# EAGLE design display (EAGLE 7.2.0)
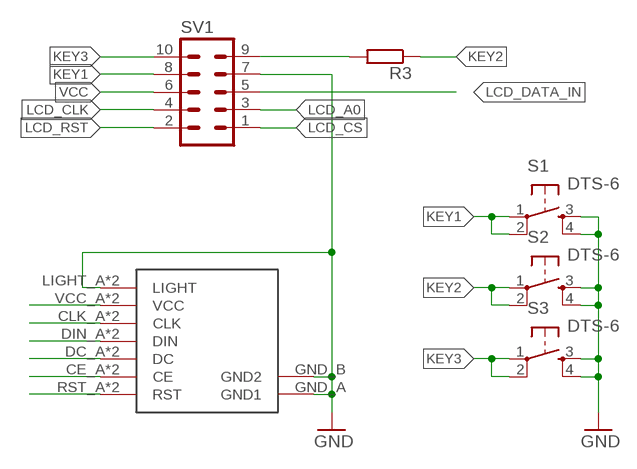
[diagram p0: schematic, sheet 1]

## Parts
R3  R-EU_R2010  [R2010]
S1  DTS-6  [DTS-6]
S2  DTS-6  [DTS-6]
S3  DTS-6  [DTS-6]
SV1  ML10L  [ML10L]
U$2  NOKIA5110_LCD  [NOKIA5110_LCD]

## Nets
GND: S1.3 S1.4 S2.3 S2.4 S3.3 S3.4 SV1.7 U$2.GND_A(GND1) U$2.GND_B(GND2) U$2.LIGHT_A(LIGHT) U$2.LIGHT_B(LIGHT)
KEY1: S1.1 S1.2 SV1.8
KEY2: R3.1 S2.1 S2.2
KEY3: S3.1 S3.2 SV1.10
LCD_A0: SV1.3 U$2.DC_A(DC) U$2.DC_B(DC)
LCD_CLK: SV1.4 U$2.CLK_A(CLK) U$2.CLK_B(CLK)
LCD_CS: SV1.1 U$2.CE_A(CE) U$2.CE_B(CE)
LCD_DATA_IN: SV1.5 U$2.DIN_A(DIN) U$2.DIN_B(DIN)
LCD_RST: SV1.2 U$2.RST_A(RST) U$2.RST_B(RST)
N$5: R3.2 SV1.9
VCC: SV1.6 U$2.VCC_A(VCC) U$2.VCC_B(VCC)

## Library data of the parts
R3 = rcl:R-EU_: RESISTOR, European symbol
S1-S3 = switch-tact:DTS-6
SV1 = con-ml:ML10L: HARTING; OC_FARNELL: unknown; OC_NEWARK: unknown
U$2 = common:NOKIA5110_LCD

## Board
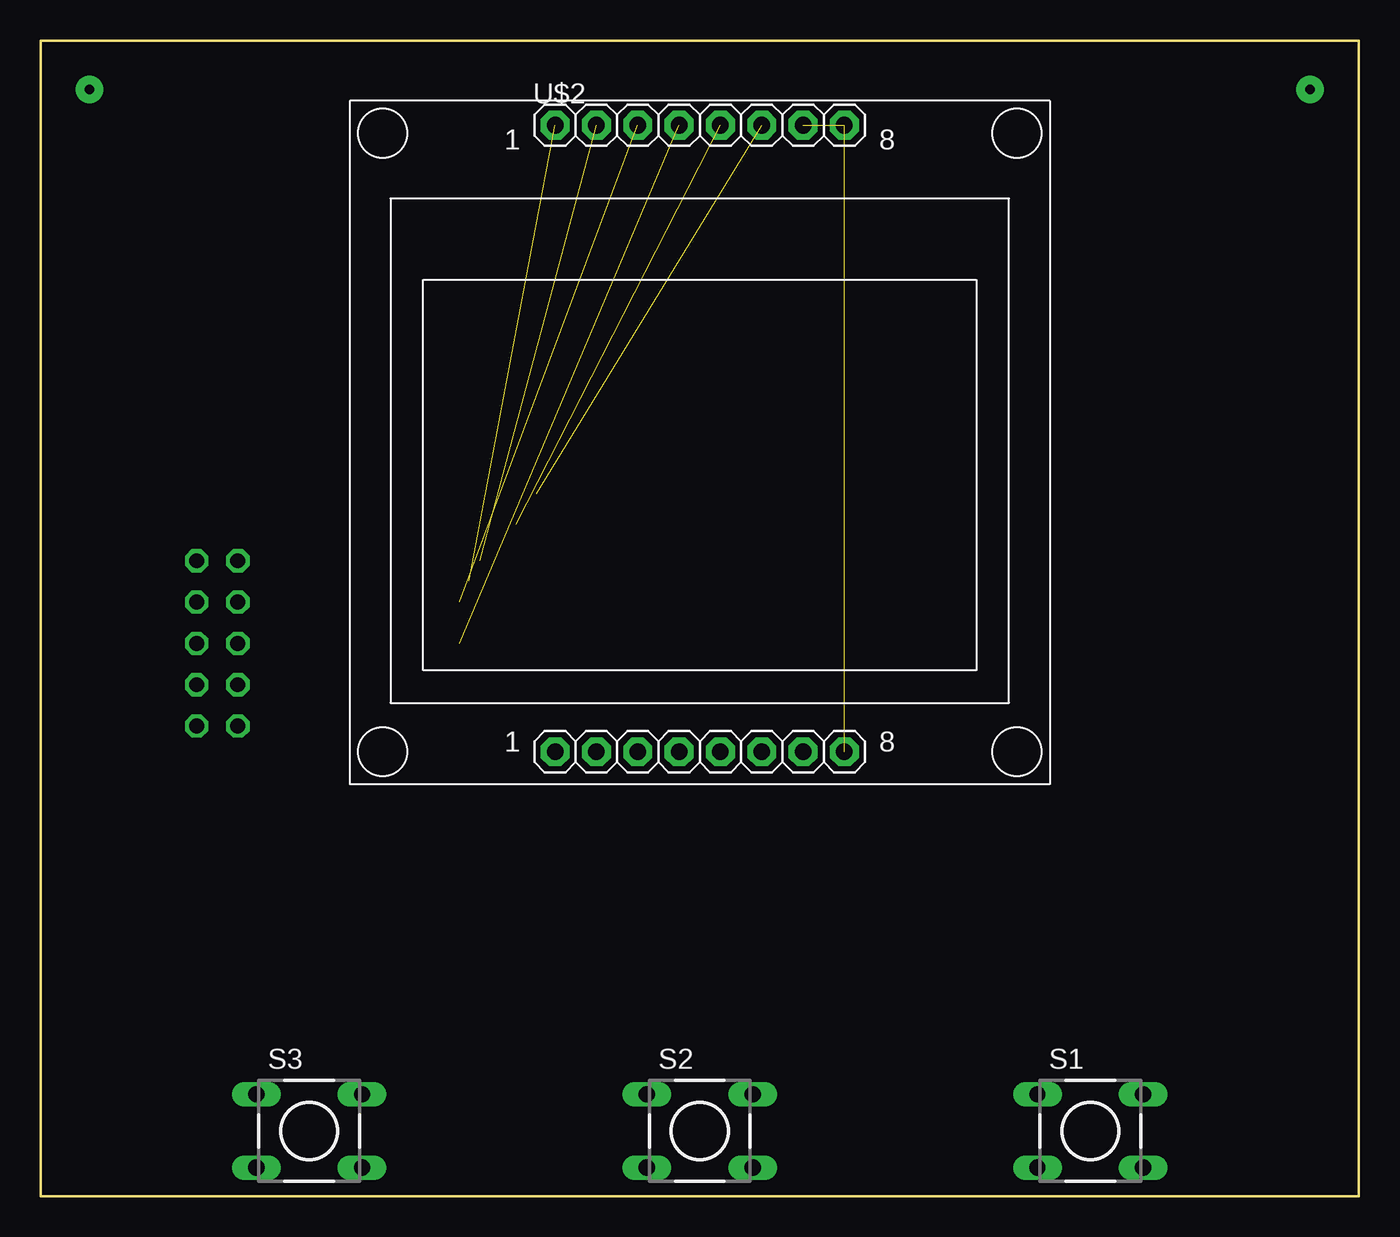
[diagram p1: board, top side]
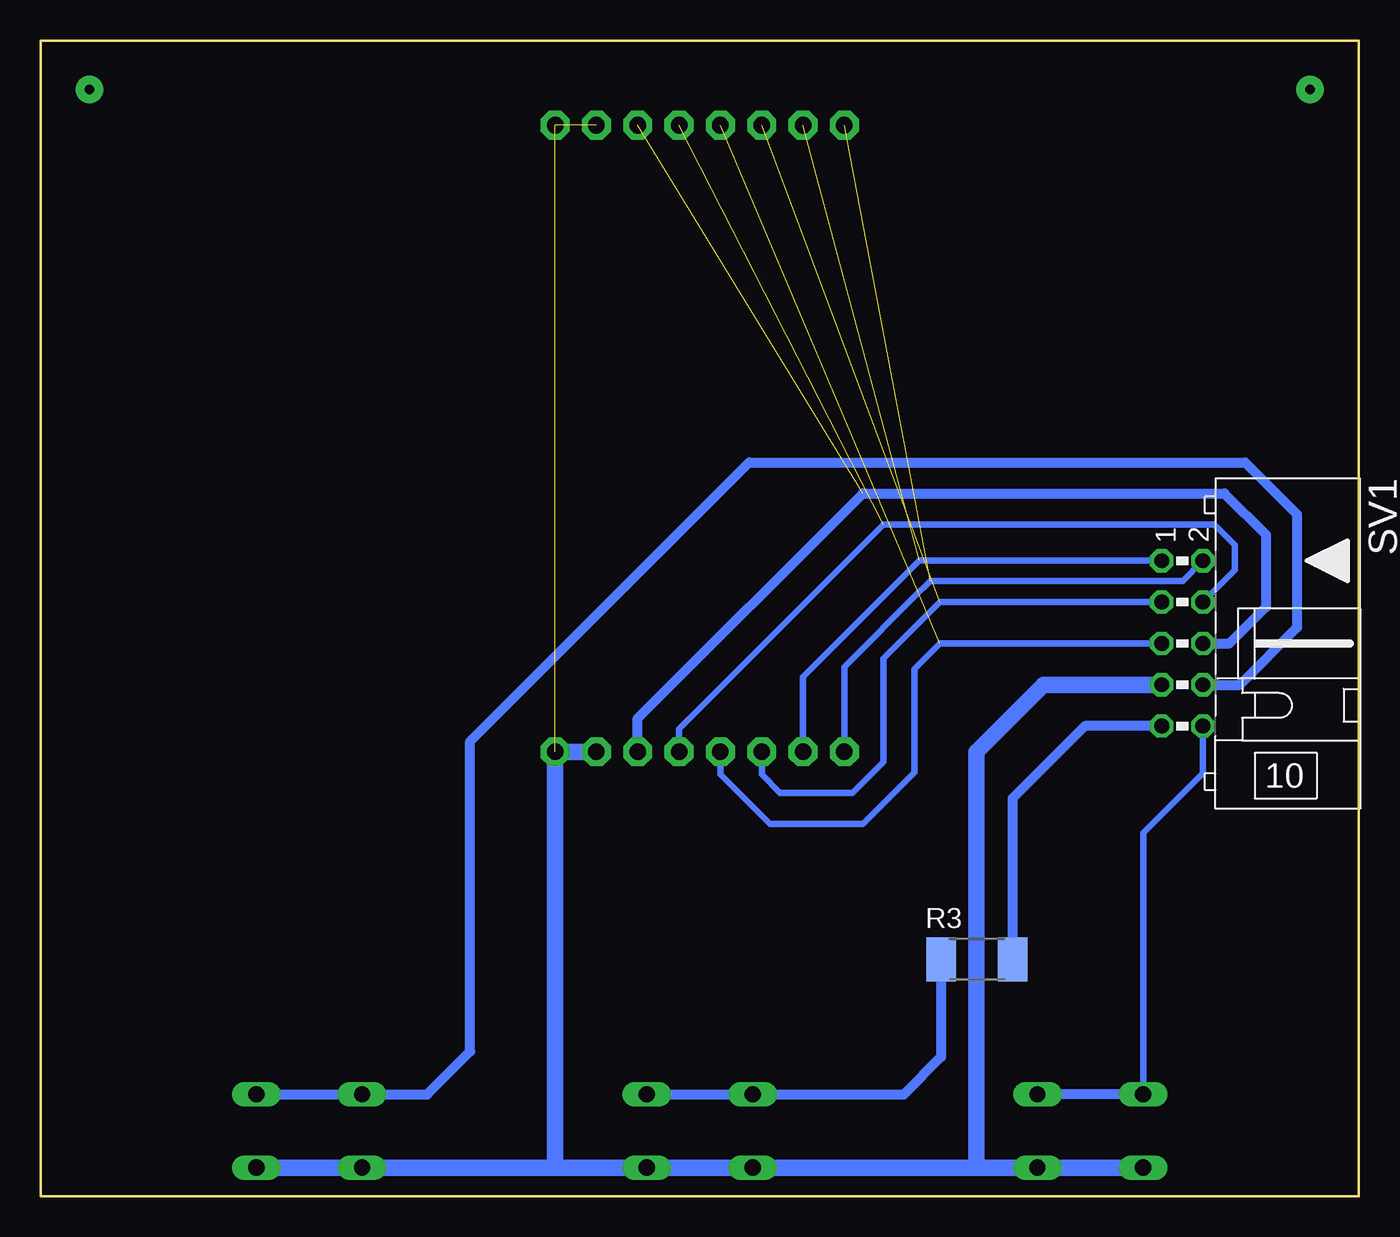
[diagram p2: board, bottom side, seen from below]

Size 81 x 71 mm. Coordinates in mm from the lower left corner, seen from the top.
Outline: 0,0 81,0 81,71 0,71 0,0
Copper layers (1*16): Top 0.035mm / dielectric 1.5mm / Bottom 0.035mm
Design rules "default": minimum track width 10mil, minimum drill 24mil, track to track 8mil, track to pad 8mil, pad to pad 8mil, via to via 8mil, smd to smd 8mil, copper to edge 40mil, drill to drill 8mil, minimum pad ring 10mil, minimum via ring 8mil, stop-mask expansion 4mil, vias tented up to drill 0mil, thermal gap 10mil

### Footprints (pad centres in the part's own frame; a part is rotated, then mirrored left to right if it is on the bottom)
R2010 = smd 1.8 x 2.7: 1 -2.2,0; 2 2.2,0
DTS-6 = drill 1 long: 1 -3.25,2.25; 2 3.25,2.25; 3 -3.25,-2.25; 4 3.25,-2.25
ML10L = drill 0.914 octagon: 1 -5.08,-1.27; 2 -5.08,1.27; 3 -2.54,-1.27; 4 -2.54,1.27; 5 0,-1.27; 6 0,1.27; 7 2.54,-1.27; 8 2.54,1.27; 9 5.08,-1.27; 10 5.08,1.27
NOKIA5110_LCD = drill 1.016 pad 1.778 octagon: CE_A -6.35,0; CE_B -6.35,38.5; CLK_A 1.27,0; CLK_B 1.27,38.5; DC_A -3.81,0; DC_B -3.81,38.5; DIN_A -1.27,0; DIN_B -1.27,38.5; GND_A 8.89,0; GND_B 8.89,38.5; LIGHT_A 6.35,0; LIGHT_B 6.35,38.5; RST_A -8.89,0; RST_B -8.89,38.5; VCC_A 3.81,0; VCC_B 3.81,38.5

### Placement (x,y rotation side)
R3  23.47,14.55 0 bottom
S1  64.5,4 0 top
S2  40.5,4 0 top
S3  16.5,4 0 top
SV1  10.85,33.96 270 bottom
U$2  40.5,27.3 0 top

### Tracks (layer width: path | path; a pad name or v marks a point on that pad's centre or on a via)
GND  (2 unrouted)
  Bottom 1.016: S3.3 S3.4 23.5,1.75 | 23.5,1.75 S2.3 S2.4 49.53,1.75 | 49.53,1.75 S1.3 S1.4 | U$2.LIGHT_A U$2.GND_A 49.39,1.89 49.53,1.75 | SV1.7 19.38,31.42 23.5,27.3 23.5,1.75
KEY1
  Bottom 0.61: S1.2 S1.1 57.25,6.25 54.61,8.89 54.61,27.94 37.47,45.09 6.99,45.09 3.81,41.91 3.81,34.92 7.32,31.42 SV1.8
KEY2
  Bottom 0.61: S2.2 S2.1 27.96,6.25 25.67,8.54 R3.1
KEY3
  Bottom 0.406: S3.1 13.25,22.31 9.58,25.98 SV1.10
  Bottom 0.61: S3.1 S3.2
LCD_A0  (1 unrouted)
  Bottom 0.406: SV1.3 25.73,36.5 29.21,33.02 29.21,26.67 31.11,24.77 35.56,24.77 36.69,25.89 U$2.DC_A
LCD_CLK  (1 unrouted)
  Bottom 0.406: SV1.4 7.62,38.46 7.62,40.01 8.89,41.27 29.21,41.27 41.77,28.71 U$2.CLK_A
LCD_CS  (1 unrouted)
  Bottom 0.406: SV1.1 27,39.04 34.15,31.89 U$2.CE_A
LCD_DATA_IN  (1 unrouted)
  Bottom 0.406: SV1.5 25.73,33.96 27.3,32.38 27.3,26.04 30.48,22.86 36.2,22.86 39.23,25.89 U$2.DIN_A
LCD_RST  (1 unrouted)
  Bottom 0.406: U$2.RST_A 31.61,32.52 26.99,37.15 26.67,37.47 26.34,37.8 10.82,37.8 SV1.2
N$1  (via drill 0.6 pad 1.68)
  other vias: 3,68
N$2  (via drill 0.6 pad 1.68)
  other vias: 78,68
N$5
  Bottom 0.61: R3.2 21.27,24.45 16.84,28.88 SV1.9
VCC  (1 unrouted)
  Bottom 0.61: SV1.6 7.95,33.96 5.71,36.2 5.71,40.64 8.26,43.18 30.48,43.18 44.31,29.35 U$2.VCC_A